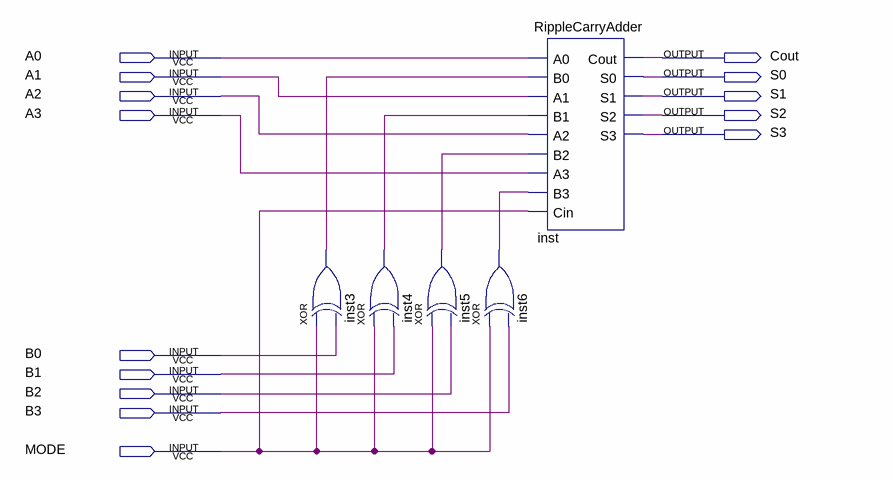
[diagram p0: schematic sheet]
// Quartus schematic Lab2.bdf as structural Verilog: 5 symbols, 14 pins
module Lab2 (
  input  A0,
  input  A1,
  input  A2,
  input  A3,
  input  B0,
  input  B1,
  input  B2,
  input  B3,
  input  MODE,
  output Cout,
  output S0,
  output S1,
  output S2,
  output S3
);

  wire inst3_out, inst4_out, inst5_out, inst6_out;

  xor inst4 (inst4_out, MODE, B1);
  xor inst3 (inst3_out, MODE, B0);
  xor inst5 (inst5_out, MODE, B2);
  xor inst6 (inst6_out, MODE, B3);
  RippleCarryAdder inst (
    .A0(A0), .B0(inst3_out), .A1(A1), .B1(inst4_out), .A2(A2), .B2(inst5_out), .A3(A3), .B3(inst6_out),
    .Cin(MODE), .Cout(Cout), .S0(S0), .S1(S1), .S2(S2), .S3(S3));
endmodule
